# EAGLE schematic legoCrawlerArduinoMegaExtension (EAGLE 7.1.0)
Lego Crawler
CNAME: Lego Crawler; CREVISION: R1; DESIGNER: Martin Abel
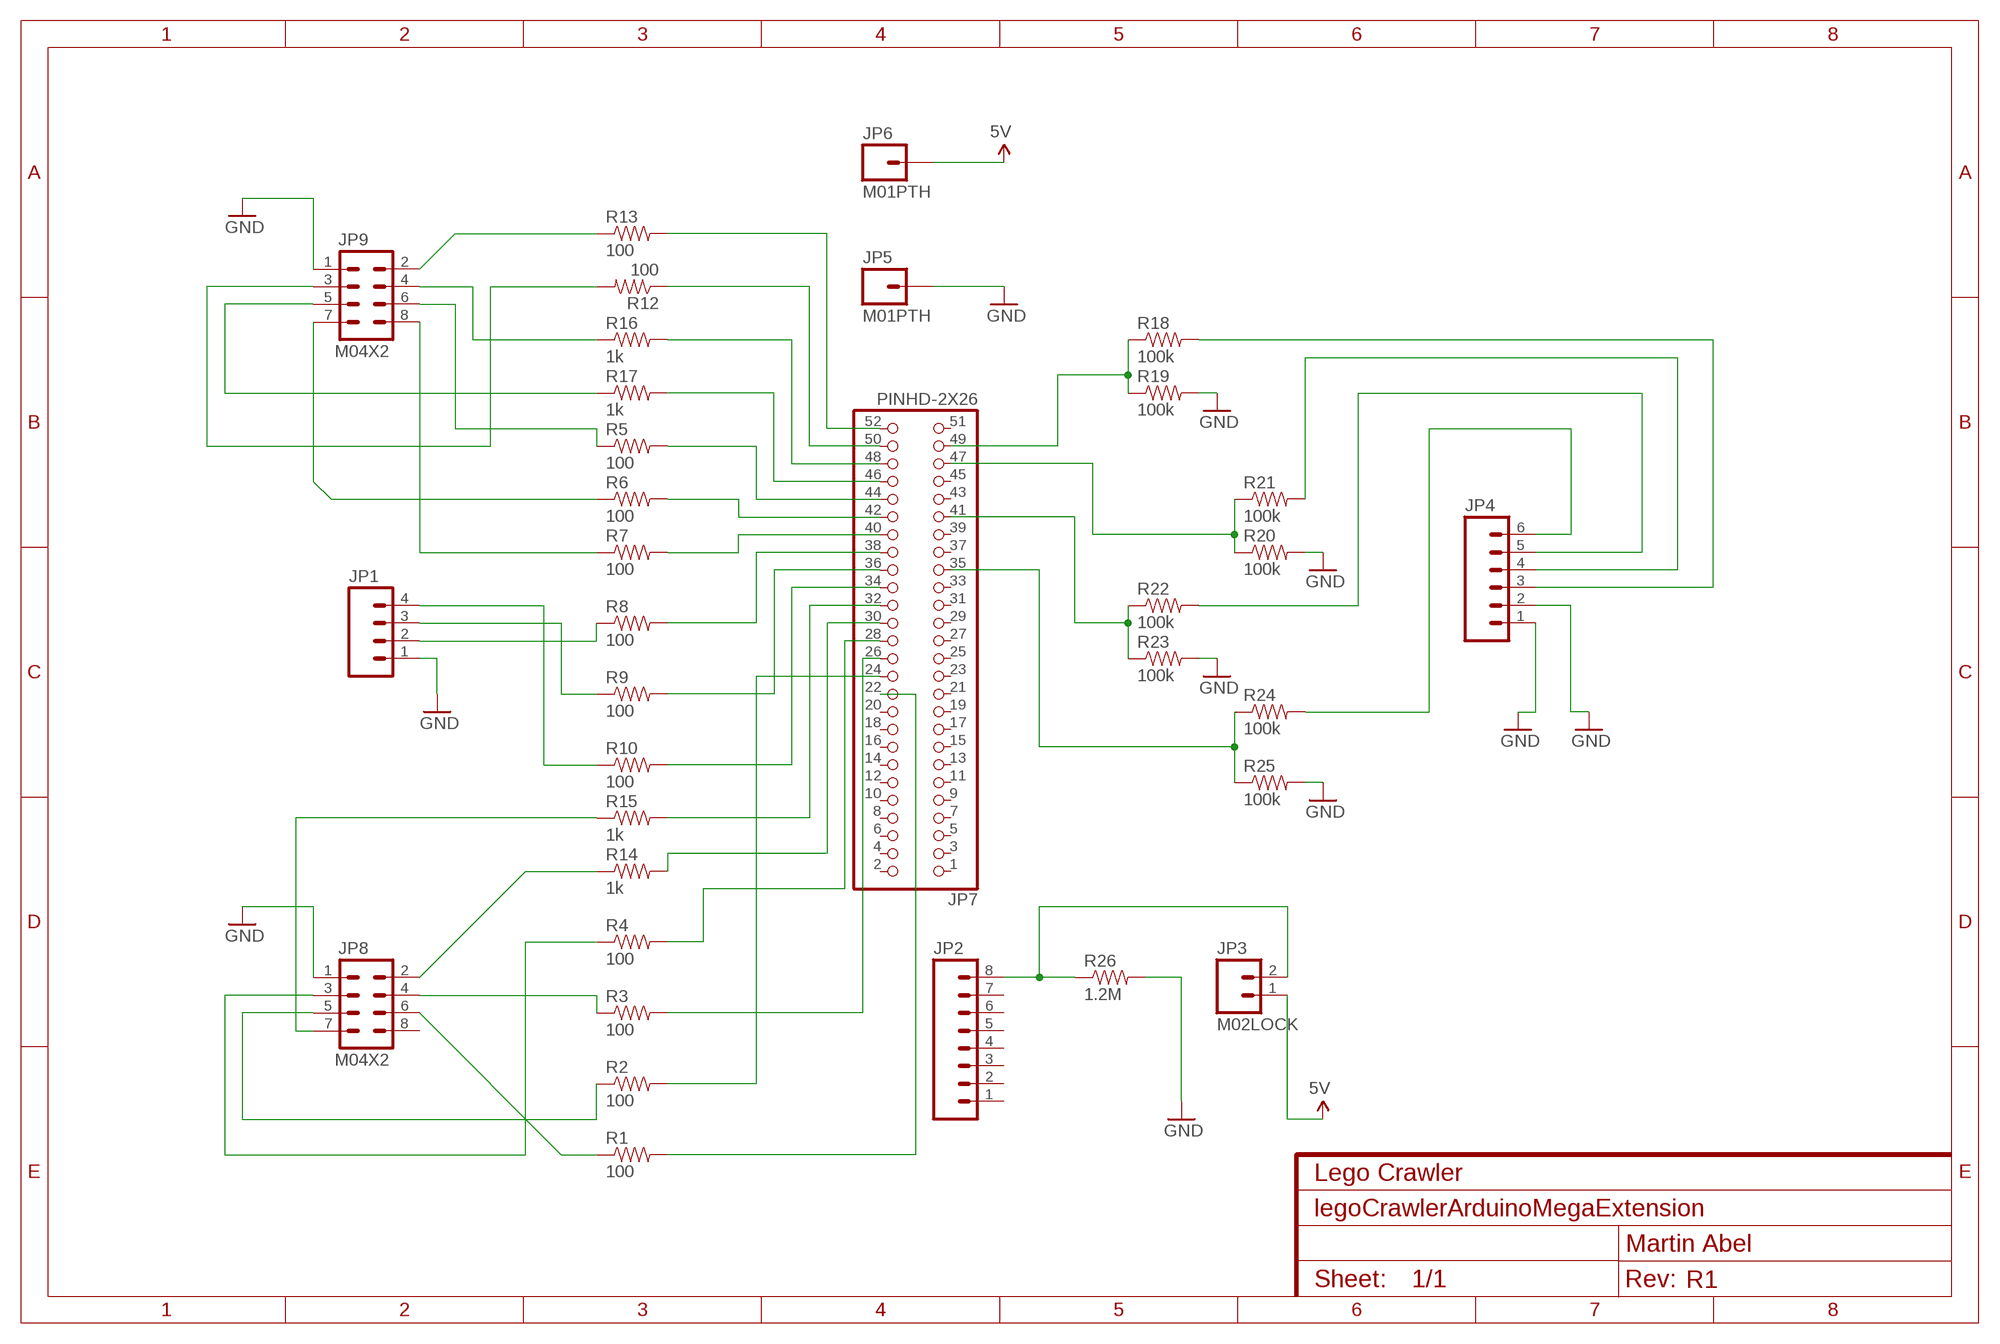
[diagram p0: schematic, sheet 1]

## Parts
JP1  M04JST  [1X04-1.5MM_JST]
JP2  M08  [1X08_ROUND]
JP3  M02LOCK  [1X02_LOCK]
JP4  M06LOCK  [1X06_LOCK]
JP5  M01PTH  [1X01]
JP6  M01PTH  [1X01]
JP7  PINHD-2X26  [2X26]
JP8  M04X2  [2X4]
JP9  M04X2  [2X4]
R1  100  10OHM-1/4W-5%(PTH)  [AXIAL-0.3]
R2  100  10OHM-1/4W-5%(PTH)  [AXIAL-0.3]
R3  100  10OHM-1/4W-5%(PTH)  [AXIAL-0.3]
R4  100  10OHM-1/4W-5%(PTH)  [AXIAL-0.3]
R5  100  10OHM-1/4W-5%(PTH)  [AXIAL-0.3]
R6  100  10OHM-1/4W-5%(PTH)  [AXIAL-0.3]
R7  100  10OHM-1/4W-5%(PTH)  [AXIAL-0.3]
R8  100  10OHM-1/4W-5%(PTH)  [AXIAL-0.3]
R9  100  10OHM-1/4W-5%(PTH)  [AXIAL-0.3]
R10  100  10OHM-1/4W-5%(PTH)  [AXIAL-0.3]
R12  100  10OHM-1/4W-5%(PTH)  [AXIAL-0.3]
R13  100  10OHM-1/4W-5%(PTH)  [AXIAL-0.3]
R14  1k  1KOHM-1/4W-5%(PTH)  [AXIAL-0.3]
R15  1k  1KOHM-1/4W-5%(PTH)  [AXIAL-0.3]
R16  1k  1KOHM-1/4W-5%(PTH)  [AXIAL-0.3]
R17  1k  1KOHM-1/4W-5%(PTH)  [AXIAL-0.3]
R18  100k  100KOHM-1/4W-5%(PTH)  [AXIAL-0.3]
R19  100k  100KOHM-1/4W-5%(PTH)  [AXIAL-0.3]
R20  100k  100KOHM-1/4W-5%(PTH)  [AXIAL-0.3]
R21  100k  100KOHM-1/4W-5%(PTH)  [AXIAL-0.3]
R22  100k  100KOHM-1/4W-5%(PTH)  [AXIAL-0.3]
R23  100k  100KOHM-1/4W-5%(PTH)  [AXIAL-0.3]
R24  100k  100KOHM-1/4W-5%(PTH)  [AXIAL-0.3]
R25  100k  100KOHM-1/4W-5%(PTH)  [AXIAL-0.3]
R26  1.2M  1.2MOHMS-1/10W-1%(0603)  [0603-RES]

## Nets
5V: JP3.1 JP6.1
GND: JP1.1 JP4.1 JP4.2 JP5.1 JP8.1 JP9.1 R19.P$2 R20.P$2 R23.P$2 R25.P$2 R26.2
N$1: JP4.3 R18.P$2
N$2: JP4.4 R21.P$2
N$3: JP4.5 R22.P$2
N$4: JP4.6 R24.P$2
N$5: JP7.49 R18.P$1 R19.P$1
N$6: JP7.41 R22.P$1 R23.P$1
N$7: JP7.47 R20.P$1 R21.P$1
N$8: JP7.35 R24.P$1 R25.P$1
N$9: JP2.8 JP3.2 R26.1
N$10: JP7.52 R13.P$2
N$11: JP7.50 R12.P$1
N$12: JP7.48 R16.P$2
N$13: JP7.46 R17.P$2
N$14: JP7.44 R5.P$2
N$15: JP7.42 R6.P$2
N$16: JP7.40 R7.P$2
N$17: JP7.38 R8.P$2
N$18: JP7.36 R9.P$2
N$19: JP7.34 R10.P$2
N$20: JP7.32 R15.P$2
N$21: JP7.30 R14.P$2
N$22: JP7.28 R4.P$2
N$23: JP7.26 R3.P$2
N$24: JP7.24 R2.P$2
N$25: JP8.7 R15.P$1
N$26: JP7.22 R1.P$2
N$27: JP9.2 R13.P$1
N$28: JP9.3 R12.P$2
N$29: JP9.4 R16.P$1
N$30: JP9.5 R17.P$1
N$31: JP9.6 R5.P$1
N$32: JP9.7 R6.P$1
N$33: JP9.8 R7.P$1
N$34: JP1.2 R8.P$1
N$35: JP1.3 R9.P$1
N$36: JP1.4 R10.P$1
N$37: JP8.2 R14.P$1
N$38: JP8.3 R4.P$1
N$39: JP8.4 R3.P$1
N$40: JP8.5 R2.P$1
N$41: JP8.6 R1.P$1
Unconnected: JP2.1 JP2.2 JP2.3 JP2.4 JP2.5 JP2.6 JP2.7 JP7.1 JP7.2 JP7.3 JP7.4 JP7.5 JP7.6 JP7.7 JP7.8 JP7.9 JP7.10 JP7.11 JP7.12 JP7.13 JP7.14 JP7.15 JP7.16 JP7.17 JP7.18 JP7.19 JP7.20 JP7.21 JP7.23 JP7.25 JP7.27 JP7.29 JP7.31 JP7.33 JP7.37 JP7.39 JP7.43 JP7.45 JP7.51 JP8.8

## Library data of the parts
JP1 = SparkFun-Connectors:M04: Header 4 Standard 4-pin 0.1" header. Use with straight break away headers (SKU : PRT-00116), right angle break away headers (PRT-00553), swiss pins (PRT-00743), machine pins (PRT-00117), and female headers (PRT-00115). Molex polarized connector foot print use with SKU : PRT-08231 with associated crimp pins and housings. 1MM SMD Version SKU: PRT-10208
JP2 = SparkFun-Connectors:M08: Header 8 Standard 8-pin 0.1" header. Use with straight break away headers (SKU : PRT-00116), right angle break away headers (PRT-00553), swiss pins (PRT-00743), machine pins (PRT-00117), and female headers (PRT-00115).
JP3 = SparkFun-Connectors:M02: Standard 2-pin 0.1" header. Use with - straight break away headers ( PRT-00116) - right angle break away headers (PRT-00553) - swiss pins (PRT-00743) - machine pins (PRT-00117) - female headers (PRT-00115) Molex polarized connector foot print use with: PRT-08233 with associated crimp pins and housings. 2.54_SCREWTERM for use with PRT-10571. 3.5mm Screw Terminal footprints for PRT-08084 5mm Screw Terminal footprints for use with PRT-08432
JP4 = SparkFun-Connectors:M06: Header 6 Standard 6-pin 0.1" header. Use with straight break away headers (SKU : PRT-00116), right angle break away headers (PRT-00553), swiss pins (PRT-00743), machine pins (PRT-00117), and female headers (PRT-00115). Molex polarized connector foot print use with SKU : PRT-08094 with associated crimp pins and housings. NOTES ON THE VARIANTS LOCK and LOCK_LONGPADS... This footprint was designed to help hold the alignment of a through-hole component (i.e. 6-pin header) while soldering it into place. You may notice that each hole has been shifted either up or down by 0.005 of an inch from it's more standard position (which is a perfectly straight line). This slight alteration caused the pins (the squares in the middle) to touch the edges of the holes. Because they are alternating, it causes a "brace" to hold the component in place. 0.005 has proven to be the perfect amount of "off-center" position when using our standard breakaway headers. Although looks a little odd when you look at the bare footprint, once you have a header in there, the alteration is very hard to notice. Also,if you push a header all the way into place, it is covered up entirely on the bottom side. This idea of altering the position of holes to aid alignment will be further integrated into the Sparkfun Library for other footprints. It can help hold any component with 3 or more connection pins.
JP5 JP6 = SparkFun-Connectors:M01: Header 1 Standard 1-pin 0.1" header. Use with straight break away headers (SKU : PRT-00116), right angle break away headers (PRT-00553), swiss pins (PRT-00743), machine pins (PRT-00117), and female headers (PRT-00115).
JP7 = SparkFun-Connectors:PINHD-2X26
JP8 JP9 = SparkFun-Connectors:M04X2: .1" header, two rows of four.
R1-R10 R12 R13 = SparkFun-Resistors:10OHM-1/4W-5%(PTH): RES-10698; PROD_ID: RES-10698; VALUE: 10
R14-R17 = SparkFun-Resistors:1KOHM-1/4W-5%(PTH): RES-08380; PROD_ID: RES-08380; VALE: 1k
R18-R25 = SparkFun-Resistors:100KOHM-1/4W-5%(PTH): RES-10686; PROD_ID: RES-10686
R26 = SparkFun-Resistors:1.2MOHMS-1/10W-1%(0603): RES-10055; PROD_ID: RES-10055